# Altium schematic sheet 5V0_PCM.SchDoc
size A4
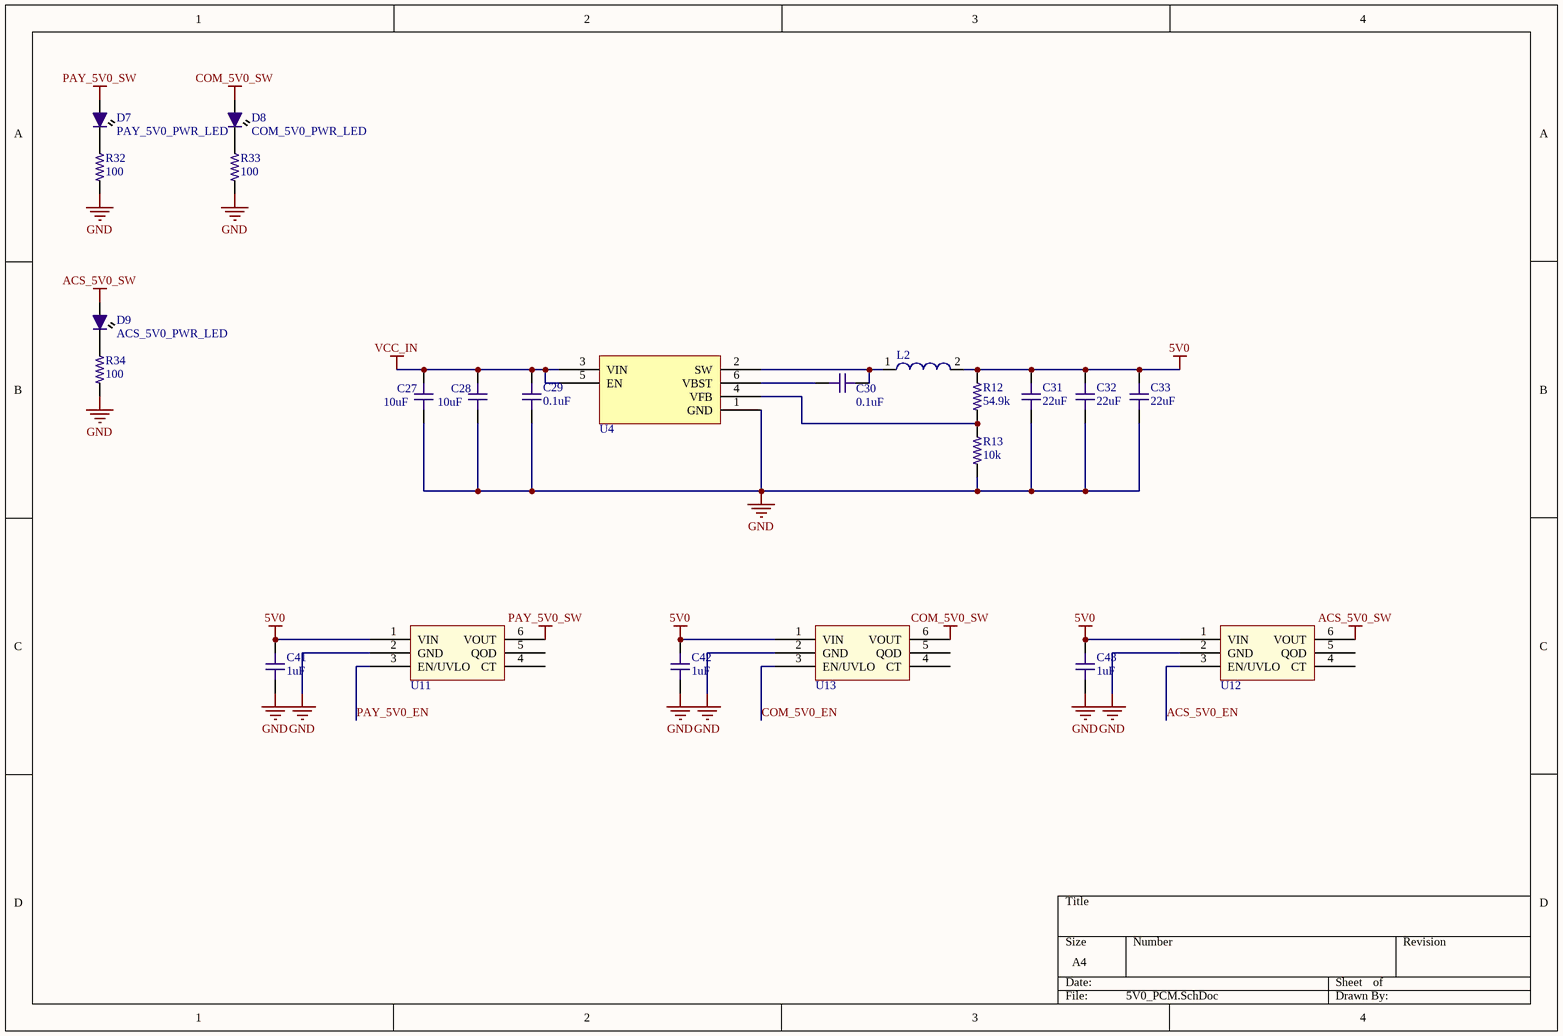
[diagram p0: 5V0_PCM.SchDoc]

## Parts
C27  value 10uF  [C1206-IPC]  (hidden comment: Cin)
C28  value 10uF  [C1206-IPC]  (hidden comment: Cin)
C29  value 0.1uF  [C0603-IPC]  (hidden comment: Cinx)
C30  value 0.1uF  [C0603-IPC]  (hidden comment: Cbst)
C31  value 22uF  [C0603-IPC]  (hidden comment: Cout)
C32  value 22uF  [C0603-IPC]  (hidden comment: Cout)
C33  value 22uF  [C0603-IPC]  (hidden comment: Cout)
C41  value 1uF  [C0603-IPC]  (hidden comment: Capacitor)
C42  value 1uF  [C0603-IPC]  (hidden comment: Capacitor)
C43  value 1uF  [C0603-IPC]  (hidden comment: Capacitor)
D7  PAY_5V0_PWR_LED  [LED0603-IPC]
D8  COM_5V0_PWR_LED  [LED0603-IPC]
D9  ACS_5V0_PWR_LED  [LED0603-IPC]
L2  74437349033  [WE-LHMI 7050]  (value not drawn)
R12  value 54.9k  [R0402-IPC]  (hidden comment: Rfbt)
R13  value 10k  [R0402-IPC]  (hidden comment: Rfbb)
R32  value 100  [R0603-IPC]  (hidden comment: 0603 Template)
R33  value 100  [R0603-IPC]  (hidden comment: 0603 Template)
R34  value 100  [R0603-IPC]  (hidden comment: 0603 Template)
U4  Buck  [SOT23-6_L]  (value not drawn)
U11  One Channel Load Switch  [TPS22810-Q1]  (value not drawn)
U12  One Channel Load Switch  [TPS22810-Q1]  (value not drawn)
U13  One Channel Load Switch  [TPS22810-Q1]  (value not drawn)

## Nets
5V0: C31.2 C32.2 C33.2 C41.2 C42.2 C43.2 L2.2 R12.2 U11.1(VIN) U12.1(VIN) U13.1(VIN)
ACS_5V0_SW: D9.A U12.6(VOUT)
COM_5V0_SW: D8.A U13.6(VOUT)
GND: C27.1 C28.1 C29.1 C31.1 C32.1 C33.1 C41.1 C42.1 C43.1 R13.1 R32.2 R33.2 R34.2 U4.1(GND) U11.2(GND) U12.2(GND) U13.2(GND)
PAY_5V0_SW: D7.A U11.6(VOUT)
VCC_IN: C27.2 C28.2 C29.2 U4.3(VIN) U4.5(EN)
ACS_5V0_EN: U12.3(EN/UVLO)
COM_5V0_EN: U13.3(EN/UVLO)
PAY_5V0_EN: U11.3(EN/UVLO)
NetC30_1: C30.1 U4.6(VBST)
NetC30_2: C30.2 L2.1 U4.2(SW)
NetD7_K: D7.K R32.1
NetD8_K: D8.K R33.1
NetD9_K: D9.K R34.1
NetR12_1: R12.1 R13.2 U4.4(VFB)

Not connected (* = marked no-connect by the designer): U11 4(CT) 5(QOD); U12 4(CT) 5(QOD); U13 4(CT) 5(QOD)

## Library data of the parts
C27 C28 = 15: Capacitor (1206) 10uF 25V X5R 1206; OrbitPartId: 15; Type: Passive; EIA Code: X5R; Max. Voltage: 25V; PartId: 1; Subtype: Capacitor; ComponentLink1Description: 12063D106KAT2A; ComponentLink1URL: https://www.digikey.ca/en/products/detail/avx-corporation/12063D106KAT2A/1950914
C29 C30 = 13: Cap Cer 0.1uF 10% 25V Cer Cap X7R 0603; OrbitPartId: 13; Type: Passive; EIA Code: X7R; Max. Voltage: 25V; PartId: 1; Subtype: Capacitor; ComponentLink1Description: C0603C104K3RACTU; ComponentLink1URL: https://www.digikey.ca/en/products/detail/kemet/C0603C104K3RACTU/416044?s=N4IgTCBcDaIMIAYBsCDMcCMCAsBpVASgIJwAqAqiALoC%2BQA
C31-C33 = 13: Cap Cer 22uF 10V X5R 0603; OrbitPartId: 13; Type: Passive; EIA Code: X5R; Max. Voltage: 10V; PartId: 1; Subtype: Capacitor; ComponentLink1Description: C1608X5R1A226M080AC; ComponentLink1URL: https://www.digikey.ca/en/products/detail/tdk-corporation/C1608X5R1A226M080AC/3661560?s=N4IgTCBcDaIMIEYBsAGAHADQKwCUEEEwwkBZdFfOEAXQF8g
C41-C43 = 13: Capacitor (0603); OrbitPartId: 13; EIA Code: X5R; Max. Voltage: 16V; Type: Passive; PartId: 1; Subtype: Capacitor
D7-D9 = LED 0603 SMD: Red PWR_LED; Supplier 1: Digi-Key; Supplier Part Number 1: 732-4966-1-ND
L2 = CMP-1353-00061-1: SMD Power Inductor WE-LHMI, L=3.3 µH; Manufacturer: Wuerth Elektronik; Inductance: 3.3 ÂµH; ComponentLink2Description: Datasheet; PartNumber: 74437349033; ComponentLink2URL: http://katalog.we-online.de/kataloge/eisos/media/pdf/74437349033.pdf; PackageReference: WE-LHMI 7050; ComponentLink1Description: Manufacturer URL; ComponentLink1URL: http://www.we-online.com
R12 = 19: 54.9k 1% 0402; OrbitPartId: 19; PartId: 1; Type: Passive; Subtype: Resistor; ComponentLink1Description: CRCW040254K9FKED; ComponentLink1URL: https://www.digikey.ca/en/products/detail/vishay-dale/crcw040254k9fked/1178205
R13 = 19: 10k 1% 0402; OrbitPartId: 19; PartId: 1; Type: Passive; Subtype: Resistor; ComponentLink1Description: CRCW040210K0FKED; ComponentLink1URL: https://www.digikey.ca/en/products/detail/vishay-dale/CRCW040210K0FKED/1178121
R32-R34 = 0603 Template: Chip Resistor, 0603, 51hms, 0.1W
U4 = TPS565208DDC: 4.5V tp 17V, 5A Synchronous Step-Down Voltage Regulator; ComponentLink1Description: Datasheet; ComponentLink1URL: http://www.ti.com/lit/ds/symlink/tps565208.pdf
U11-U13 = TPS22810-Q1: 2.7 - 18V @ 2A Max